# Altium schematic sheet Block_Diagram.SchDoc: Arduino Shield
size A4; DocumentNumber: SCH-ARD-SHIELD; Revision: A; SheetNumber: 2; SheetTotal: 3
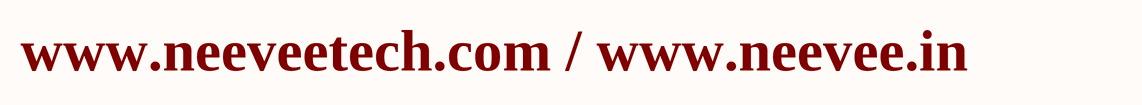
[diagram p0: Block_Diagram.SchDoc]

## Notes on the sheet
- www.neeveetech.com / www.neevee.in
- Title
- Size:
- A4
- Number:
- Revision:
- Date:
- Time:
- Sheet
- of